# Altium schematic sheet machnguon.SchDoc
size 420 x 297 mm; SheetNumber: 1; SheetTotal: 1
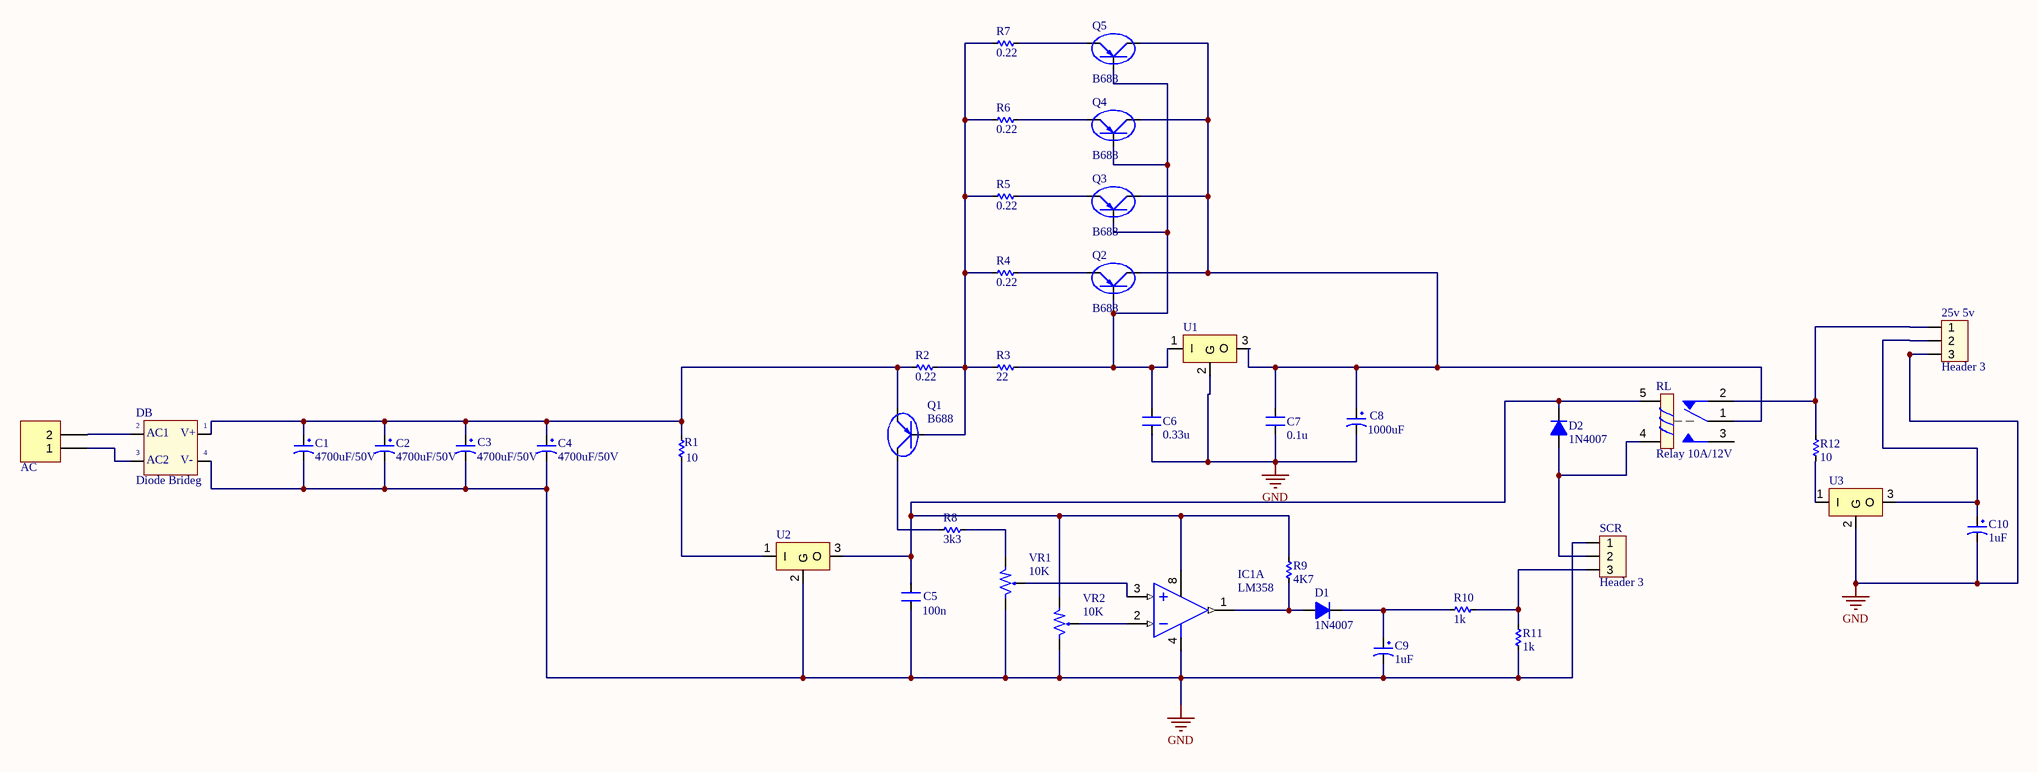
[diagram p0: machnguon.SchDoc]

## Parts
25v_5v  Header 3  [HED3]
AC  Header 2_1  [HED2]  (value not drawn)
C1  4700uF/50V  [CP4/8.5]
C2  4700uF/50V  [CP4/8.5]
C3  4700uF/50V  [CP4/8.5]
C4  4700uF/50V  [CP4/8.5]
C5  100n  [CN1]
C6  0.33u  [CN1]
C7  0.1u  [CN1]
C8  1000uF  [CP1.5/3.4]
C9  1uF  [CP1/2]
C10  1uF  [CP1/2]
D1  1N4007  [D1A]
D2  1N4007  [D1A]
DB  Diode Brideg  [CAU 5A]
IC1  LM358  [DIP8]  (part A of 2)
Q1  B688  [QTO-247]
Q2  B688  [QTO-247]
Q3  B688  [QTO-247]
Q4  B688  [QTO-247]
Q5  B688  [QTO-247]
R1  10  [RES-2W]
R2  0.22  [RES-2W]
R3  22  [RES-2W]
R4  0.22  [RES-2W]
R5  0.22  [RES-2W]
R6  0.22  [RES-2W]
R7  0.22  [RES-2W]
R8  3k3  [RES-2W]
R9  4K7  [RES-2W]
R10  1k  [RES-2W]
R11  1k  [RES-2W]
R12  10  [RES-2W]
RL  Relay 10A/12V  [RELAY 5]
SCR  Header 3  [HED3]
U1  LM78xx  [TO220-123]  (value not drawn)
U2  LM78xx  [TO220-123]  (value not drawn)
U3  LM78xx  [TO220-123]  (value not drawn)
VR1  10K  [VR1]
VR2  10K  [VR1]

## Nets
GND: 25v_5v.3 C1.2 C2.2 C3.2 C4.2 C5.1 C6.1 C7.1 C8.2 C9.2 C10.2 DB.4(-V_OUT) IC1.4(-V) R11.2 SCR.1 U1.2(G) U2.2(G) U3.2(G) VR1.3 VR2.3
Net25v_5v_1: 25v_5v.1 R12.1 RL.2
Net25v_5v_2: 25v_5v.2 C10.1 U3.3(O)
NetAC_1: AC.1 DB.3(AC2)
NetAC_2: AC.2 DB.2(AC1)
NetC1_1: C1.1 C2.1 C3.1 C4.1 DB.1(+V_OUT) Q1.3(E) R1.1 R2.2
NetC5_2: C5.2 D2.2(K) IC1.8(+V) R9.1 RL.5 U2.3(O) VR2.1
NetC6_2: C6.2 Q2.1(B) Q3.1(B) Q4.1(B) Q5.1(B) R3.1 U1.1(I)
NetC7_2: C7.2 C8.1 Q2.2(C) Q3.2(C) Q4.2(C) Q5.2(C) RL.1 U1.3(O)
NetC9_1: C9.1 D1.2(K) R10.2
NetD1_1: D1.1(A) IC1.1(OUT) R9.2
NetD2_1: D2.1(A) RL.4 SCR.2
NetIC1_2: IC1.2(IN-) VR2.2
NetIC1_3: IC1.3(IN+) VR1.2
NetQ1_1: Q1.1(B) R2.1 R3.2 R4.2 R5.2 R6.2 R7.2
NetQ1_2: Q1.2(C) R8.2
NetQ2_3: Q2.3(E) R4.1
NetQ3_3: Q3.3(E) R5.1
NetQ4_3: Q4.3(E) R6.1
NetQ5_3: Q5.3(E) R7.1
NetR1_2: R1.2 U2.1(I)
NetR8_1: R8.1 VR1.1
NetR10_1: R10.1 R11.1 SCR.3
NetR12_2: R12.2 U3.1(I)

Not connected (* = marked no-connect by the designer): RL 3

## Notes on the sheet
- THIS DOCUMENT AND THE DATA DISCLOSED HEREIN OR
- HEREWITH IS THE PROPERTY OF ALTIUM LIMITED AND MAY
- DWG NO:
- REVISION
- REV:
- DESCRIPTION
- DATE
- APPROVED
- BE FREELY DISTRIBUTED IN WHOLE. NO RIGHTS ARE
- RESERVED OR EXPRESS OR IMPLIED WARANTEE GIVEN.
- ENG:
- APPROVALS
- PROJECT
- DSN:
- CHK:
- REFERENCE DOCUMENTS
- PROJECT REVISION:
- TITLE
- DOCUMENT REVISION:
- DESIGN ITEM:
- BOM:
- FAB DWG:
- PCB DWG:
- ASSY DWG:
- SCALE:
- A3
- SIZE
- CAGE CODE
- FILE NAME
- DWG NO.
- SHEET
- OF
- REV
- (in symbol DB) V+; V-

## Library data of the parts
25v_5v SCR = Hed3: Header 3 (Green); Value: Header 3
AC = Header 2_1: Header, 2-Pin; Manufacturer: Generic Components; Class: Connector; Value: Header 2
C1-C4 = CP7: Cap 4700uF/50V; Value: 4700uF/50V
C5-C7 = CN1: Cap np  1pF - 472pF; Value: 100pF
C8 = CP4: Cap 1000uF/16V - 220uF/50V; Description 5: 4,7uF>10uF/250V_3,3uF>10uF/400V - 2,2uF>4,7uF/450V; Description 1: 2200uF-3300uF/6,3V - 1000uF-2200uF/10V; Description 2: 1000uF/16V - 470uF => 1000uF/25V - 100uF/100V; Description 3: 330uF>470uF/35V_220uF>470uF/50V_10uF>22uF/250V; Description 4: 220uF => 330uF/63V - 10uF =>33uF/160 - 200V; Value: 1000uF/16V
C9 C10 = CP1: Cap P  0,1uF < 22uF , 16 - 50V; Value: 10uF/50V; Description 1: 10 => 220uF/6,3V/10V - 10uF => 100uF/16V; Description 2: 0,1uF => 33uF/50V - 10uF => 22uF/63V; Description 3: 0,47uF => 10uF/100V
D1 D2 = D1A: Diode 1A; Value: 1N4007
DB = DB: Convert AC to DC voltage, 4 pin; Value: Cau 1A
IC1 = LM358: Low-Power Dual Operational Amplifier; Value: LM358
Q1-Q5 = B688: Transistor Power Supply; Value: B688
R1-R12 = Res: Manufacturer: Generic Components; Class: Passive; SubClass: R; Published: 08/06/2000; Publisher: Altium Hobart Technology Centre
RL = Relay 5: Relay SPDT,10A - 12VDC 5 Pin; Value: Relay SPDT, 10A, 12V
U1-U3 = LM78xx: Positive Voltage Regulator; Note: Tab is connected to pin 3 (GND).; Published: 24-Aug-2001; LatestRevisionDate: 17-Jul-2002; LatestRevisionNote: Re-released for DXP Platform.; DatasheetVersion: Apr-1994; PackageVersion: Jul-1998; PackageReference: ISOWATT220AB; Publisher: Altium Limited; PackageDescription: TO, Thru-Hole, Vertical, Heatsink Mounted; 3 In-Line Leads; Pitch 2.54 mm; Pin sequence 1, 3, 2; ComponentLink1Description: Manufacturer Link; ComponentLink1URL: http://www.st.com/; ComponentLink2Description: Datasheet; ComponentLink2URL: http://www.st.com/stonline/products/literature/ds/2146/l78m05c.pdf
VR1 VR2 = VR1: Var Resistor; Value: VR 10K